# EAGLE board Edgecutter (EAGLE 7.7.0)
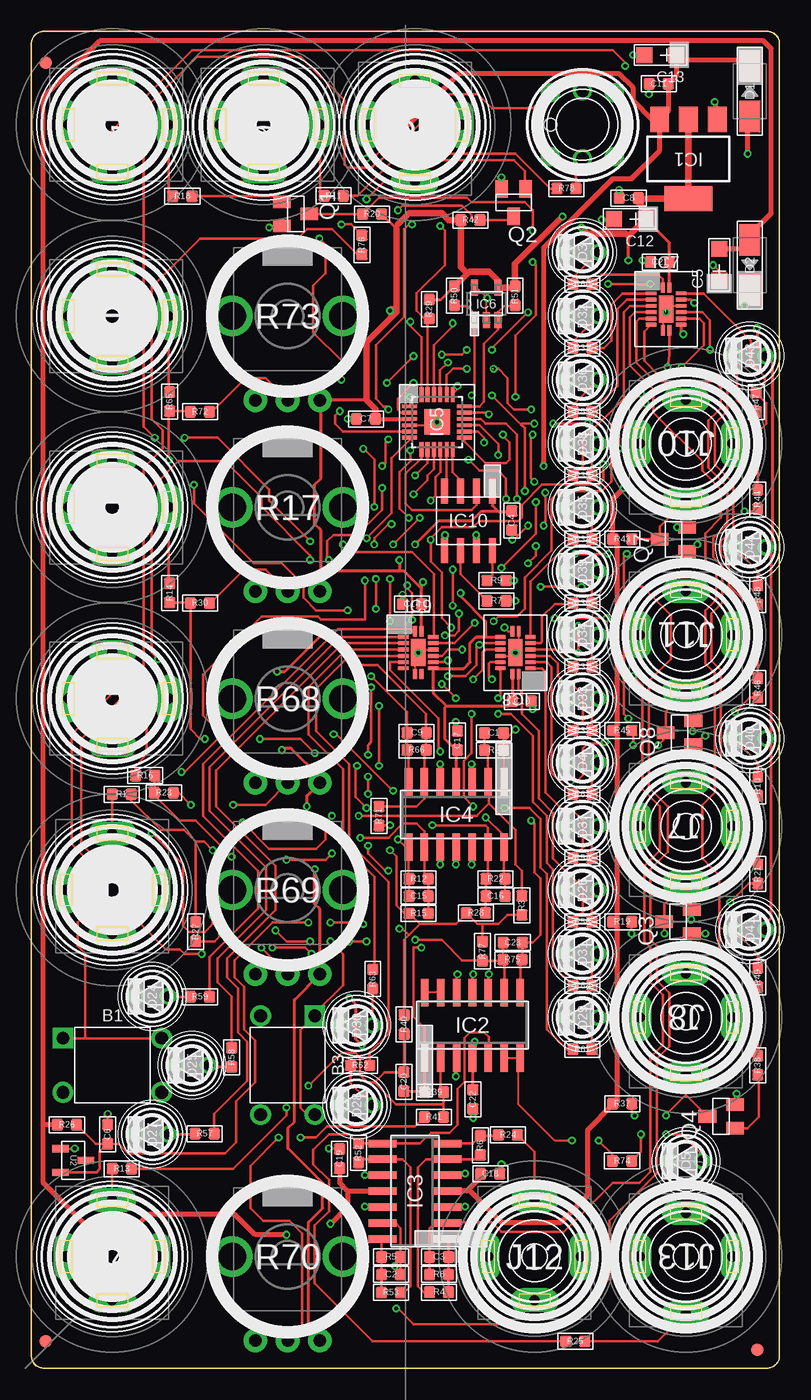
[diagram p6: board, top side]
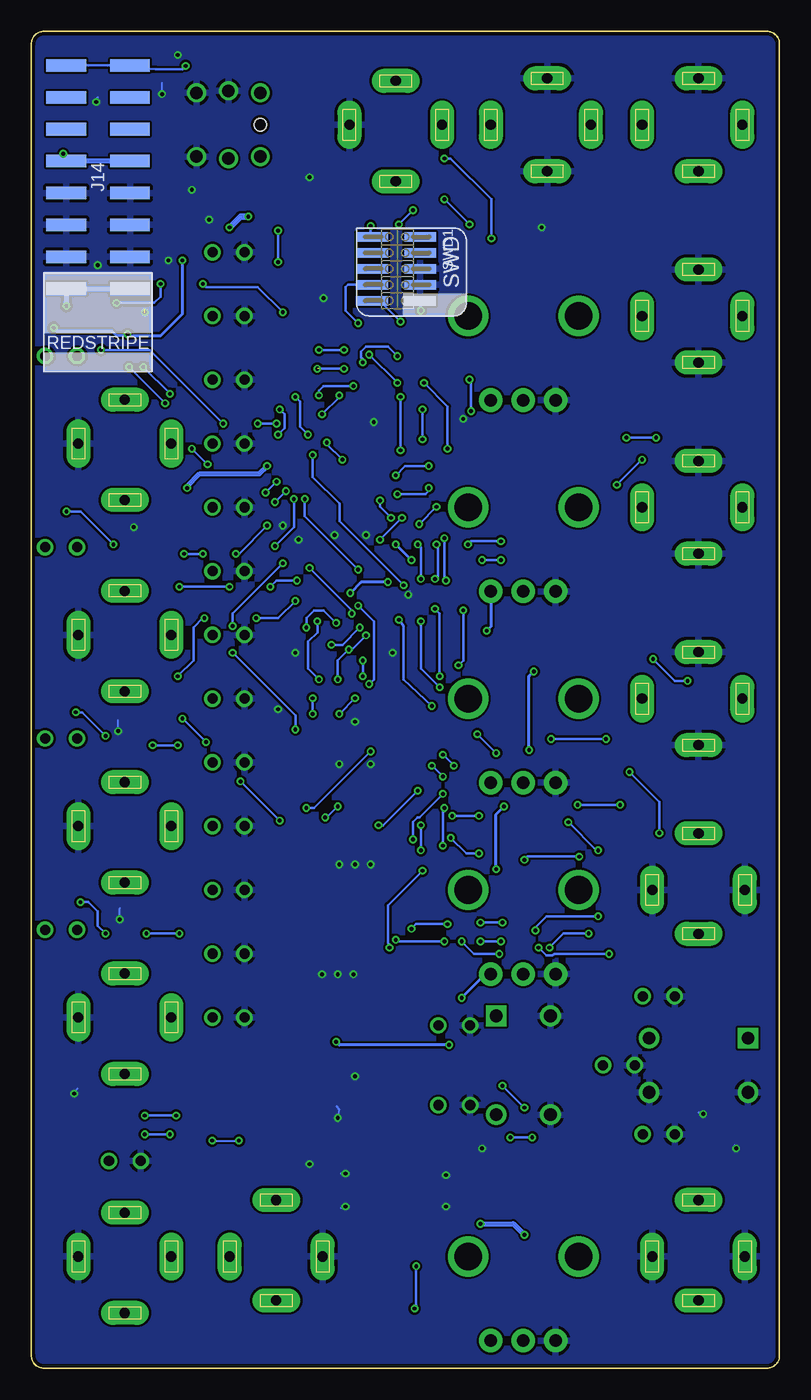
[diagram p7: board, bottom side, seen from below]

Size 59.62 x 106.5 mm. Coordinates in mm from the lower left corner, seen from the top.
Copper layers (1*16): Top 0.035mm / dielectric 1.5mm / Bottom 0.035mm
Design rules "dirt_cheap_dirty_boards.v1 *": minimum track width 5mil, minimum drill 12mil, track to track 5mil, track to pad 5mil, pad to pad 5mil, via to via 5mil, smd to smd 0mil, copper to edge 10mil, drill to drill 10mil, minimum pad ring 10mil, minimum via ring 6mil, stop-mask expansion 2mil, vias tented up to drill 25mil, thermal gap 10mil
Net classes: 0 default: width 0.203 mm, clearance 0.178 mm; 1 heavypower: width 0.381 mm; 2 mediumpower: width 0.254 mm; 3 groundplane: width 0.178 mm, clearance 0.178 mm

## Footprints (pad centres in the part's own frame; a part is rotated, then mirrored left to right if it is on the bottom)
4P-6.0X6.0X5.0H = drill 1.016 pad 1.651 square: 1 -3.937,2.159 | drill 1.016 pad 1.651: 2 -3.937,-2.159; 3 3.937,-2.159; 4 3.937,2.159
C0603 = smd 0.889 x 0.889: 1 -0.762,0; 2 0.762,0
AVX-A = smd 1.27 x 1.27: + -1.27,0; - 1.27,0
DO-214AC = smd 2.5 x 1.7: 1 -2,0; 2 2,0
3MMLED = drill 0.8: + -1.27,0; - 1.27,0
FIDUCIAL_1MM = smd 1 x 1: 1 0,0
SOT223 = smd 1.5 x 2: 1 -2.3,-3.15; 2 0,-3.15; 3 2.3,-3.15 | smd 3.8 x 2: 4 0,3.15
SO14 = smd 0.6 x 2.2: 1 -3.81,-2.6; 2 -2.54,-2.6; 3 -1.27,-2.6; 4 0,-2.6; 5 1.27,-2.6; 6 2.54,-2.6; 7 3.81,-2.6; 8 3.81,2.6; 9 2.54,2.6; 10 1.27,2.6; 11 0,2.6; 12 -1.27,2.6; 13 -2.54,2.6; 14 -3.81,2.6
QFN50P400X400X100-25N = smd 1.2 x 0.3: 1 -2.2,1.245; 2 -2.2,0.762; 3 -2.2,0.254; 4 -2.2,-0.254; 5 -2.2,-0.762; 6 -2.2,-1.245; 13 2.2,-1.245; 14 2.2,-0.762; 15 2.2,-0.254; 16 2.2,0.254; 17 2.2,0.762; 18 2.2,1.245 | smd 0.3 x 1.2: 7 -1.245,-2.2; 8 -0.762,-2.2; 9 -0.254,-2.2; 10 0.254,-2.2; 11 0.762,-2.2; 12 1.245,-2.2; 19 1.245,2.2; 20 0.762,2.2; 21 0.254,2.2; 22 -0.254,2.2 | smd 0.305 x 1.2: 23 -0.762,2.2; 24 -1.245,2.2 | smd 2.032 x 2.032: 25 0,0
SOT95P290X145-5N = smd 1.27 x 0.559: 1 -1.295,0.94; 2 -1.295,0; 3 -1.295,-0.94; 4 1.295,-0.94; 5 1.295,0.94
QFN50P250X350X100-17N = smd 0.305 x 0.813: 1 -0.254,1.702; 8 -0.254,-1.702; 9 0.254,-1.702; 16 0.254,1.702 | smd 0.813 x 0.305: 2 -1.194,1.245; 3 -1.194,0.762; 4 -1.194,0.254; 5 -1.194,-0.254; 6 -1.194,-0.762; 7 -1.194,-1.245; 10 1.194,-1.245; 11 1.194,-0.762; 12 1.194,-0.254; 13 1.194,0.254; 14 1.194,0.762; 15 1.194,1.245 | smd 1.143 x 2.159: 17 0,0
SOIC8-N_MC = smd 1.981 x 0.559: 1 -2.362,1.905; 2 -2.362,0.635; 3 -2.362,-0.635; 4 -2.362,-1.905; 5 2.362,-1.905; 6 2.362,-0.635; 7 2.362,0.635; 8 2.362,1.905
3.5MM-JACK-SWITCH-13MM-INPUT = drill 0.8 pad 1.93 long: RING@3 -3.7,0; SECOND@3 0,-3.5; SWITCH@3 3.7,0; TIP@3 0,4.5
3.5MM-JACK-SWITCH-13MM-OUTPUT = drill 0.8 pad 1.93 long: RING@3 -3.7,0; SECOND@3 0,-3.5; SWITCH@3 3.7,0; TIP@3 0,4.5
2X08_SMT_HEADER = smd 1 x 3.17: 1 -8.89,-2.54; 2 -8.89,2.54; 3 -6.35,-2.54; 4 -6.35,2.54; 5 -3.81,-2.54; 6 -3.81,2.54; 7 -1.27,-2.54; 8 -1.27,2.54; 9 1.27,-2.54; 10 1.27,2.54; 11 3.81,-2.54; 12 3.81,2.54; 13 6.35,-2.54; 14 6.35,2.54; 15 8.89,-2.54; 16 8.89,2.54
SOT23-BEC = smd 1 x 1.4: B -0.95,-1.1; C 0,1.1; E 0.95,-1.1
R0603 = smd 0.889 x 0.889: 1 -0.762,0; 2 0.762,0
OG-POTS_ALPS_POT_VERTICAL = drill 1 pad 1.88: P$1 -2.58,-6.7; P$2 0,-6.7; P$3 2.58,-6.7 | drill 2.2 pad 3.175: P$4 4.4,0; P$5 -4.4,0
M50-3600542 = smd 0.75 x 2.5: 1 -2.54,-1.81; 2 -2.54,2; 3 -1.27,-1.81; 4 -1.27,2; 5 0,-1.81; 6 0,2; 7 1.27,-1.81; 8 1.27,2; 9 2.54,-1.81; 10 2.54,2
SOT95P237X112-3N = smd 1.321 x 0.559: 1 -1.016,0.94; 2 -1.016,-0.94; 3 1.016,0
PB6149L = drill 1: 1 2.54,2.54; 2 2.54,-2.54; 3 -2.54,2.54; 4 -2.54,-2.54; LEDNEG 0,-2.7; LEDPOS 0,2.7 | hole 1: 2.54,0

## Placement (x,y rotation side)
B1  BUTTON-4P-3110040P1  [4P-6.0X6.0X5.0H]  6.45,24.13 0 top
B3  BUTTON-4P-3110040P1  [4P-6.0X6.0X5.0H]  20.42,24.13 270 top
C1  3.3nF  [C0603]  36.86,50.6 0 top
C2  3.3nF  [C0603]  28.66,7.46 180 top
C3  3.3nF  [C0603]  32.48,8.86 0 top
C4  100nF  [C0603]  38.29,67.53 90 top
C5  10uF  [AVX-A]  54.82,87.9 90 top
C6  100nF  [C0603]  6.08,18.64 270 top
C7  100nF  [C0603]  26.66,75.62 0 top
C8  100nF  [C0603]  47.6,93.22 0 top
C9  3.3nF  [C0603]  30.7,50.62 180 top
C10  100nF  [C0603]  39.08,53.12 180 top
C11  100nF  [C0603]  49.99,102.32 0 top
C12  10uF  [AVX-A]  47.68,91.55 180 top
C13  10uF  [AVX-A]  50.14,104.62 180 top
C14  100nF  [C0603]  30.33,60.88 0 top
C15  3.3nF  [C0603]  30.86,37.6 180 top
C16  3.3nF  [C0603]  36.99,37.6 0 top
C17  100nF  [C0603]  33.95,50 90 top
C18  100nF  [C0603]  36.57,15.49 180 top
C19  100nF  [C0603]  24.57,16.69 270 top
C20  3.3nF  [C0603]  29.69,22.82 270 top
C21  100nF  [C0603]  50.08,88.12 0 top
C22  100nF  [C0603]  35.18,21.41 270 top
C23  3.3nF  [C0603]  38.36,33.9 0 top
D1  MRA4004T3G  [DO-214AC]  57.25,101.73 90 top
D2  MRA4004T3G  [DO-214AC]  57.25,87.88 270 top
D3  yellow  [3MMLED]  43.91,88.9 180 top
D4  yellow  [3MMLED]  43.91,48.26 180 top
D5  yellow  [3MMLED]  52.17,16.51 180 top
D24  yellow  [3MMLED]  9.62,29.62 180 top
D25  yellow  [3MMLED]  12.8,24.13 180 top
D26  yellow  [3MMLED]  43.91,38.1 180 top
D27  yellow  [3MMLED]  9.62,18.63 180 top
D28  yellow  [3MMLED]  25.92,20.95 180 top
D29  yellow  [3MMLED]  43.91,27.94 180 top
D30  yellow  [3MMLED]  25.92,27.3 180 top
D31  yellow  [3MMLED]  43.91,33.02 180 top
D32  yellow  [3MMLED]  43.91,83.82 180 top
D33  yellow  [3MMLED]  43.91,53.34 180 top
D34  yellow  [3MMLED]  43.91,58.42 180 top
D35  yellow  [3MMLED]  43.91,68.58 180 top
D36  yellow  [3MMLED]  43.91,78.74 180 top
D37  yellow  [3MMLED]  43.91,43.18 180 top
D38  yellow  [3MMLED]  43.91,73.66 180 top
D39  yellow  [3MMLED]  43.91,63.5 180 top
D40  yellow  [3MMLED]  57.25,50.16 180 top
D41  yellow  [3MMLED]  57.25,34.92 180 top
D43  yellow  [3MMLED]  57.25,80.64 180 top
D44  yellow  [3MMLED]  57.25,65.41 180 top
FID1  FIDUCIAL  [FIDUCIAL_1MM]  1.15,104.01 180 top
FID2  FIDUCIAL  [FIDUCIAL_1MM]  57.86,1.46 0 top
FID3  FIDUCIAL  [FIDUCIAL_1MM]  1.13,2.13 0 top
IC1  LD1117AS33TR  [SOT223]  52.36,96.33 180 top
IC2  MCP6004  [SO14]  35.15,27.32 0 top
IC3  TL074D  [SO14]  30.58,14.1 90 top
IC4  MCP6004  [SO14]  33.86,44.1 180 top
IC5  MKL02Z32VFK4  [QFN50P400X400X100-25N]  32.33,75.38 0 top
IC6  24LC16T-I/OT  [SOT95P290X145-5N]  36.25,84.8 90 top
IC7  74HC595BQ  [QFN50P250X350X100-17N]  50.58,84.38 0 top
IC8  74HC595BQ  [QFN50P250X350X100-17N]  38.58,57 180 top
IC9  74HC595BQ  [QFN50P250X350X100-17N]  30.83,57 0 top
IC10  MCP4822-E/SN  [SOIC8-N_MC]  34.83,67.5 270 top
J1  PJ-341  [3.5MM-JACK-SWITCH-13MM-INPUT]  6.45,68.58 270 top
J2  PJ-341  [3.5MM-JACK-SWITCH-13MM-INPUT]  6.45,53.34 270 top
J3  PJ-341  [3.5MM-JACK-SWITCH-13MM-INPUT]  6.45,38.1 0 top
J4  PJ-341  [3.5MM-JACK-SWITCH-13MM-INPUT]  6.45,8.89 0 top
J5  PJ-341  [3.5MM-JACK-SWITCH-13MM-INPUT]  6.45,99.06 270 top
J6  PJ-341  [3.5MM-JACK-SWITCH-13MM-INPUT]  18.52,99.06 270 top
J7  PJ-341  [3.5MM-JACK-SWITCH-13MM-OUTPUT]  52.17,43.18 180 top
J8  PJ-341  [3.5MM-JACK-SWITCH-13MM-OUTPUT]  52.17,27.94 180 top
J9  PJ-341  [3.5MM-JACK-SWITCH-13MM-INPUT]  30.58,99.06 180 top
J10  PJ-341  [3.5MM-JACK-SWITCH-13MM-OUTPUT]  52.17,73.66 180 top
J11  PJ-341  [3.5MM-JACK-SWITCH-13MM-OUTPUT]  52.17,58.42 180 top
J12  PJ-341  [3.5MM-JACK-SWITCH-13MM-OUTPUT]  40.1,8.89 0 top
J13  PJ-341  [3.5MM-JACK-SWITCH-13MM-OUTPUT]  52.17,8.89 180 top
J14  POWERSMT  [2X08_SMT_HEADER]  54.3,94.89 90 bottom
J15  PJ-341  [3.5MM-JACK-SWITCH-13MM-INPUT]  6.45,83.82 270 top
OUTLINE  EURORACK_PCB12HP  [EURORACK12HPPCB]  -0.5,0 0 top
Q1  MMBT3904  [SOT23-BEC]  21.06,91.95 270 top
Q2  MMBT3904  [SOT23-BEC]  38.44,92.86 180 top
Q3  MMBT3904  [SOT23-BEC]  51.53,35.56 90 top
Q4  MMBT3904  [SOT23-BEC]  54.97,20.06 90 top
Q7  MMBT3904  [SOT23-BEC]  51.17,66.04 90 top
Q8  MMBT3904  [SOT23-BEC]  51.66,50.62 90 top
R1  100k  [R0603]  7.2,45.72 180 top
R2  33k  [R0603]  36.86,49.23 180 top
R3  51k  [R0603]  39.09,36.87 270 top
R4  100k  [R0603]  32.48,6.05 180 top
R5  30k  [R0603]  28.66,8.86 0 top
R6  100k  [R0603]  35.78,17.75 90 top
R7  12k  [R0603]  37.07,61.12 180 top
R8  30k  [R0603]  32.48,7.46 180 top
R9  12k  [R0603]  37.07,62.75 180 top
R10  56  [R0603]  57.88,46.35 270 top
R11  100k  [R0603]  24.09,93.4 0 top
R12  33k  [R0603]  30.86,38.98 0 top
R13  100k  [R0603]  7.21,15.88 180 top
R14  100k  [R0603]  11.03,61.76 90 top
R15  51k  [R0603]  30.86,36.23 180 top
R16  100k  [R0603]  9.07,47.21 180 top
R17  10kB  [OG-POTS_ALPS_POT_VERTICAL]  20.42,68.58 0 top
R18  100k  [R0603]  12.04,93.36 0 top
R19  10k  [R0603]  47.09,35.56 180 top
R20  10k  [R0603]  27.14,91.94 0 top
R21  100k  [R0603]  57.88,39.37 270 top
R22  33k  [R0603]  36.99,38.98 180 top
R23  33k  [R0603]  10.56,45.84 0 top
R24  100  [R0603]  37.98,18.59 180 top
R25  100  [R0603]  43.35,2.13 180 top
R26  10k  [R0603]  2.83,19.39 0 top
R27  33k  [R0603]  13.09,34.77 270 top
R28  51k  [R0603]  35.42,36.27 180 top
R29  10k  [R0603]  31.7,84.38 270 top
R30  33k  [R0603]  13.44,60.96 0 top
R31  56  [R0603]  43.91,55.88 180 top
R32  56  [R0603]  43.91,50.8 180 top
R33  56  [R0603]  43.91,81.28 0 top
R34  56  [R0603]  43.91,66.04 180 top
R35  56  [R0603]  43.91,71.12 180 top
R36  56  [R0603]  43.91,60.96 180 top
R37  10k  [R0603]  47.09,21.07 180 top
R38  100k  [R0603]  57.88,24.13 270 top
R39  33k  [R0603]  32.1,21.98 0 top
R40  51k  [R0603]  29.7,27.38 90 top
R41  33k  [R0603]  32.08,20 180 top
R42  10k  [R0603]  35,91.47 180 top
R43  10k  [R0603]  47.09,66.04 180 top
R44  100k  [R0603]  57.88,69.22 270 top
R45  10k  [R0603]  47.09,50.8 180 top
R46  100k  [R0603]  57.88,54.19 270 top
R47  56  [R0603]  57.76,76.96 90 top
R48  56  [R0603]  57.88,61.59 270 top
R49  56  [R0603]  57.88,31.11 270 top
R50  2k  [R0603]  33.71,85.43 270 top
R51  2k  [R0603]  38.55,85.43 270 top
R52  100k  [R0603]  26.07,17.14 90 top
R53  100k  [R0603]  28.66,6.03 0 top
R54  56  [R0603]  43.91,40.64 180 top
R55  56  [R0603]  43.91,76.2 0 top
R56  56  [R0603]  43.91,35.56 180 top
R57  56  [R0603]  13.82,18.68 0 top
R58  56  [R0603]  15.97,24.77 90 top
R59  56  [R0603]  13.44,29.59 0 top
R60  56  [R0603]  43.91,86.36 0 top
R61  56  [R0603]  43.91,25.4 180 top
R62  56  [R0603]  26.2,24.12 0 top
R63  56  [R0603]  27.2,31 90 top
R64  56  [R0603]  43.91,30.48 180 top
R65  100k  [R0603]  11.02,77 90 top
R66  33k  [R0603]  30.7,49.25 0 top
R67  56  [R0603]  43.91,45.72 180 top
R68  10kB  [OG-POTS_ALPS_POT_VERTICAL]  20.42,53.34 0 top
R69  10kB  [OG-POTS_ALPS_POT_VERTICAL]  20.42,38.1 0 top
R70  10kB  [OG-POTS_ALPS_POT_VERTICAL]  20.42,8.89 0 top
R71  51k  [R0603]  27.7,43.99 270 top
R72  33k  [R0603]  13.44,76.2 0 top
R73  10kB  [OG-POTS_ALPS_POT_VERTICAL]  20.42,83.82 0 top
R74  56  [R0603]  47.08,16.51 180 top
R75  33k  [R0603]  38.34,32.55 180 top
R76  100k  [R0603]  26.34,89.48 90 top
R77  51k  [R0603]  35.95,33.22 90 top
R78  56  [R0603]  42.64,93.98 180 top
SWD1  CORTEX_SWD  [M50-3600542]  30.45,87.58 90 bottom
U2  LM4040DIM3-5.0  [SOT95P237X112-3N]  3.33,16.55 0 top
U$2  SWITCH_W_LED_PB6149L-X-102YELLOW  [PB6149L]  43.91,99.06 180 top

## Tracks (layer width: path | path; a pad name or v marks a point on that pad's centre or on a via)
3.3V  (via drill 0.3)
  Top 0.254: IC10.1 36.73,68.72 37.2,68.25 | 37.2,68.25 38.25,68.25 C4.2 | C8.2 48.4,93.18 48.4,92.81 | D41.+ 58.52,35.44 58.95,35.88 58.95,49.73 D40.+ 58.52,50.19 58.95,50.62 58.95,64.97 D44.+ 58.52,65.44 59.08,66 59.08,80.08 D43.+ | 38.58,86.09 R51.1 | IC6.4 37.2,86.64 | 34.9,87.38 34.74,87.22 | 33.66,86.25 R50.1 32.66,85.14 R29.1 | R70.P$3 23,2.46 22.08,3.38 22.08,11.62 23.2,12.75 23.2,14.75 20.45,17.5 20.45,19.12 20.95,19.62 20.95,29.36 R69.P$3 23,36.58 22.58,37 v22.58,39.75 | R20.2 29.08,90.76 29.2,91.12 | IC5.3 | C22.1 35.18,24.68 IC2.4 | 35.96,58.24 35.45,58.24 34.95,57.75 34.95,56.25 34.45,55.75 IC9.10 32.02,53.81 33.08,52.75 | 35.96,58.24 36.2,58.24 | 36.2,58.24 IC8.10 | IC9.16 31.08,60.3 C14.2 31.09,62.11 | IC8.16 38.33,53.13 C10.2 37.94,52.75 33.08,52.75 | IC7.16 C21.2 arc-90 C21.2 50.84,89.65 C12.+ | R17.P$3 23.08,61.8 23.08,63.5 | 26.7,77.12 R73.P$3 23.08,77.04 23.08,70.88 22.58,70.38 22.58,67.25 23.08,66.75 23.08,63.5 | v28.58,84.25 28.7,84.38 | D43.+ 58.52,80.69 | IC7.10 51.77,82.56 v51.95,82.38 | v47.58,88.25 47.58,90.18 | v57.83,82.88 57.83,81.33 D43.+ | 29.2,63.5 29.7,63.5 31.09,62.11 | 29.2,63.5 23.08,63.5 | 37.2,68.25 35.83,68.25 35.08,67.5 32.45,67.5 v30.58,65.62 | v29.33,64.38 29.33,63.62 29.2,63.5 | IC4.4 33.86,49.15 C17.1 33.84,49.24 32.95,50.12 32.95,52.62 33.08,52.75 | IC2.4 35.15,25.82 v35.33,26 35.33,24.9 IC2.4 | v25.33,29.5 25.83,29 25.83,26.25 v26.33,25.75 | v21.95,44.75 21.95,45.59 R68.P$3 23,47.08 20.7,49.38 20.08,49.38 v19.95,49.25 | v19.58,55.5 20.2,55.5 23.33,58.62 v23.33,58.75 | 35.96,58.24 35.46,58.24 | 31.09,62.11 31.09,62.51 v31.2,62.62 | v34.2,61.75 34.2,61.5 36.2,59.5 36.2,58.24
  Top 0.305: C7.2 IC5.3
  Top 0.508: IC1.2 IC1.4 48.4,93.18 | 48.4,92.81 49.08,92.12 49.08,91.68 C12.+ 47.58,90.18 47.39,90.38 44.33,90.38 v43.83,90.88 | IC6.4 38.58,86.09 | 37.2,86.64 36.45,87.38 34.9,87.38 | R50.1 34.74,87.22 34.24,87.72 R42.2 33.24,91.47 32.7,92 30.08,92 29.2,91.12 | 29.08,90.76 29.08,84.12 28.7,83.75 | C7.2 27.42,76.41 26.7,77.12 26.7,81.75 28.7,83.75 | 28.7,84.38 28.7,83.75 | R51.1 38.55,87.97 v42.33,91.75
  Bottom 0.254: SWD1.1 28.65,84.44 v28.58,84.25 | v47.58,88.25 47.58,84 49.33,82.25 51.83,82.25 v51.95,82.38 51.95,82.25 52.83,82.25 53.2,82.62 57.58,82.62 v57.83,82.88 | v30.58,65.62 v29.33,64.38 | R69.P$3 23.43,31.4 v25.33,29.5 | v26.33,25.75 35.08,25.75 v35.33,26 | v22.58,39.75 22.58,44.12 v21.95,44.75 | v19.95,49.25 19.95,55.12 v19.58,55.5 | R17.P$3 23,59.08 v23.33,58.75 | v31.2,62.62 33.33,62.62 v34.2,61.75
  Bottom 0.508: v42.33,91.75 42.95,91.75 v43.83,90.88
12V  (via drill 0.3)
  Top 0.381: C18.2 35.81,15.23 34.83,14.25 | 34.83,14.25 34.7,14.12 33.21,14.12 IC3.4 | IC1.3 50.75,100.17 C11.2 51.41,102.98 C13.+ 51.79,104.23 56.75,104.23 D1.2 | IC1.3 49.48,99.48 47.95,101 47.95,102 46.83,103.12 34.08,103.12 29.95,99 26.94,99 J9.SWITCH@3 | 34.83,14.25 37.45,11.62 42.2,11.62 44.33,13.75 44.33,19 46.33,21 R37.2 46.7,21.45 46.7,35.18 R19.2 46.39,35.56 46.7,35.88 46.7,50.42 R45.2 46.33,50.87 46.7,51.25 46.7,65.66 R43.2 46.33,69.25 v47.2,70.12 | v40.83,71.88 40.83,89.25 46.33,94.75 47.83,94.75 50.08,97 50.08,99.46 IC1.3
  Bottom 0.381: v47.2,70.12 47.2,70.25 46.2,71.25 41.45,71.25 v40.83,71.88
-12V  (via drill 0.3)
  Top 0.381: IC3.11 25.23,14.1 25.2,14.12 | 25.2,14.12 24.58,14.75 24.58,15.92 C19.2 | C5.- 56.54,89.17 D2.1 57.25,90.3 58.95,92 58.95,105.12 58.33,105.75 5.46,105.75 0.96,101.25 0.96,19.38 | 25.2,14.12 25.2,12.88 v23.83,11.5 | v20.33,10.62 17.83,10.62 16.2,12.25 9.33,12.25 8.21,11.12 4.58,11.12 0.96,14.75 0.96,19.38 | R26.1 0.97,19.39 0.96,19.38
  Bottom 0.381: v23.83,11.5 21.2,11.5 v20.33,10.62
ADC_ATTACK  (via drill 0.3)
  Top 0.203: IC4.7 30.05,49.14 R66.1 C9.2 29.94,52.26 v27.08,55.12 | v27.45,60.5 v27.45,62.88 | v27.33,68.62 27.33,72.38 v26.45,73.25 | v28.7,67.25 28.45,67.25 27.33,66.12 v27.33,65.62 | v33.2,80.12 32.58,79.5 32.58,77.62 IC5.21 | v28.33,78.5 v30.45,80.62
  Bottom 0.203: v27.08,55.12 27.08,60.12 v27.45,60.5 | v28.33,78.5 26.45,76.62 v26.45,73.25 | v28.7,67.25 v27.33,68.62 | v27.33,65.62 27.2,65.5 27.2,63.12 v27.45,62.88 | v33.2,80.12 33.2,80.38 33.33,80.5 33.33,81 32.95,81.38 31.2,81.38 v30.45,80.62
ADC_CURVE  (via drill 0.3)
  Top 0.203: C20.2 31.26,22.06 R39.1 IC2.1 31.34,27.11 30.45,28 30.45,33.5 v31.08,33.5 | IC5.10 32.58,71.38 32.2,71 32.2,69.5 v31.83,69.12 | v27.08,54.25 27.08,49.88 26.83,49.62 v26.83,48.88 | v28.58,62.88 v28.58,59.5 | v30.95,67.75 v28.83,65.62 | v28.45,39.62 28.2,39.62 26.83,41 v26.83,41.62 | v26.7,44.62 25.83,45.5 25.83,47.88 v25.95,48
  Bottom 0.203: v31.83,69.12 31.83,68.62 v30.95,67.75 | v27.08,54.25 28.58,55.75 v28.58,59.5 | v28.58,62.88 28.58,65.38 v28.83,65.62 | v31.08,33.5 31.08,33.75 31.2,33.88 31.2,36.88 v28.45,39.62 | v26.83,41.62 26.83,44.5 v26.7,44.62 | v26.83,48.88 v25.95,48
ADC_DECAY  (via drill 0.3)
  Top 0.203: C16.2 R22.1 37.67,39.06 IC4.14 37.58,41.62 37.58,42.5 v36.2,43.88 | IC5.14 35.59,74.61 36.08,74.12 v36.08,73.75 | v37.83,69.25 37.83,70.88 37.2,71.5 35.7,71.5 v34.83,72.38 | v33.58,60.75 v33.58,63.62 | v33.83,53.38 v32.7,54.5 | v35.08,52.12 35.08,49 34.45,48.38 34.45,45.5 v35.2,44.75
  Bottom 0.203: v37.83,69.25 37.83,67.88 v33.58,63.62 | v33.58,60.75 32.33,59.5 32.33,54.88 v32.7,54.5 | v35.08,52.12 v33.83,53.38 | v35.2,44.75 36.08,43.88 v36.2,43.88 | v34.83,72.38 36.08,73.62 v36.08,73.75
ADC_RELEASE  (via drill 0.3)
  Top 0.203: IC4.1 37.67,49.18 R2.1 37.63,50 | 37.63,50 C1.2 | IC5.16 35.83,75.63 36.2,75.25 37.83,75.25 38.7,74.38 v38.7,69.25 | v40.2,65.5 40.2,64.75 v39.58,64.12 | v43.58,57 v43.58,59.12 | v38.58,50.88 37.7,50 37.63,50
  Bottom 0.203: v38.7,69.25 38.7,67 v40.2,65.5 | v39.58,64.12 43.58,60.12 v43.58,59.12 | v43.58,57 38.58,52 v38.58,50.88
ADC_SUSTAIN  (via drill 0.3)
  Top 0.203: C15.2 R12.1 30.05,39.03 IC4.8 29.95,41.38 v29.2,42.12 | IC5.15 35.71,75.12 37.2,73.62 v37.2,72.75 | v29.95,62.38 29.95,62.12 30.33,61.75 v30.33,59.62 | v27.7,48 v27.7,52.75 | v26.83,45.75 v26.83,47.12
  Bottom 0.203: v37.2,72.75 37.2,71 35.08,68.88 35.08,67.5 v29.95,62.38 | v30.33,59.62 29.95,59.12 29.95,54.88 v27.7,52.75 | v26.83,47.12 v27.7,48 | v26.83,45.75 28.7,43.88 28.83,43.88 29.2,43.5 v29.2,42.12
ADC_VELOCITY  (via drill 0.3)  (1 unrouted)
  Top 0.203: IC2.8 38.96,32.4 R75.1 39.12,32.57 C23.2 39.98,33.9 40.58,34.5 40.58,39 40.08,39.5 40.08,43.38 v39.83,43.62 | v42.95,46.75 43.45,46.75 43.95,47.25 43.95,49.38 44.33,49.75 45.58,49.75 v45.7,49.88 | v47.58,51.75 47.2,52.12 47.2,64.62 v47.45,64.88 | v43.33,64.88 v45.95,64.88 | v40.95,69.75 40.95,67.25 v40.83,67.12 | v40.08,70.62 39.83,70.88 39.83,74.25 v39.95,74.38 | v39.83,76.38 38.45,76.38 37.95,76.88 37.95,78.88 37.2,79.62 36.7,79.62 | v34.7,79.62 33.58,79.62 33.08,79.12 33.08,77.62 IC5.20
  Bottom 0.203: v42.95,46.75 v39.83,43.62 | v47.58,51.75 v45.7,49.88 | v45.95,64.88 v47.45,64.88 | v40.08,70.62 v40.95,69.75 | v39.95,74.38 39.45,74.88 39.45,76 v39.83,76.38 | v34.7,79.62 v36.83,79.62 | v40.83,67.12 43.08,64.88 v43.33,64.88
BUTTON_LOOP  (via drill 0.3)
  Top 0.203: B3.4 22.01,20.19 21.45,20.75 21.45,26.94 B3.1 22.58,28.25 24.83,30.5 24.83,33 v23.83,34 | IC5.6 30.13,73.92 28.7,72.5 28.7,68.12 v26.7,66.12 | v26.58,62.75 26.58,59.62 23.08,59.62 22.83,59.88 18.33,59.88 13.71,55.25 13.71,52 14.83,50.88 14.83,50.12 12.21,47.5 v11.96,47.5 | v22.2,34 20.33,34 v19.45,34.88 | v14.46,36 14.46,35.38 13.83,34.75 12.58,34.75 12.08,35.25 12.08,40.12 v9.58,42.62
  Bottom 0.203: v26.7,66.12 26.7,62.88 v26.58,62.75 | v23.83,34 v22.2,34 | v19.45,34.88 19.45,35.12 18.58,36 v14.46,36 | v9.58,42.62 9.58,45.12 v11.96,47.5
BUTTON_TIMERANGE  (via drill 0.3)
  Top 0.203: B1.1 4.27,26.29 | 4.27,26.29 B1.4 | IC5.9 32.08,71.62 31.58,71.12 31.58,70.75 v30.45,69.62 | 4.27,26.29 4.27,33.06 3.71,33.62 3.71,35.5 4.58,36.38 4.58,40.38 3.21,41.75 3.21,50.5 7.46,54.75 v7.33,54.75 | v10.08,56.5 9.58,57 9.58,70.12 11.71,72.25 15.46,72.25 18.33,69.38 18.33,68.62 22.2,64.75 v22.2,64.38 | v23.7,64.38 23.58,64.5 23.58,65.88 24.08,66.38 25.95,66.38 27.95,68.38 v27.95,70.12
  Bottom 0.203: v7.33,54.75 8.33,54.75 v10.08,56.5 | v23.7,64.38 v22.2,64.38 | v30.45,69.62 28.2,69.62 27.95,69.88 v27.95,70.12
BUTTON_TRIGGER  (via drill 0.3)
  Top 0.203: IC5.5 24.84,74.61 24.2,75.25 24.2,75.88 v24.58,76.25 | v24.7,78.75 24.7,80.25 22.45,82.5 22.45,86.25 23.45,87.25 23.45,89.5 v22.95,90 | U$2.2 41.18,101.6 40.08,100.5 40.08,100.38 | 40.08,100.38 40.08,97.81 U$2.1 | 40.08,100.38 36.7,100.38 35.58,101.5 33.33,101.5 29.83,98 28.83,98 27.2,96.38 v26.7,96.38
  Bottom 0.203: v24.58,76.25 24.58,78.62 v24.7,78.75 | v22.95,90 22.95,93.12 26.2,96.38 v26.7,96.38
CLOCK  (via drill 0.3)
  Top 0.203: IC9.11 32.04,56.25 33.2,56.25 arc90 v33.2,56.38 | v33.2,55.12 34.58,55.12 35.45,56 35.45,57.5 35.64,57.69 | 35.64,57.69 35.72,57.76 IC8.11 | IC7.11 53.22,83.61 53.58,83.25 53.58,81.5 v51.83,79.75 | v30.2,77.38 30.2,76.62 IC5.1 | v30.2,73.12 30.2,72.25 29.33,71.38 29.33,68.5 v30.08,67.75 | v35.7,57.62 35.64,57.69 | v48.95,76.88 46.83,74.75 v46.83,73.25 | v45.58,72 45.58,70.75 45.2,70.38 40.7,70.38 39.08,68.75 39.08,67.75 38.83,67.5 35.7,67.5 35.2,67 32.7,67 31.83,66.12 v31.83,66 31.83,64.25 32.7,63.38 32.7,59.75 v33.45,59
  Bottom 0.203: v33.2,56.38 v33.2,55.12 | v30.2,73.12 v30.2,77.38 | v31.83,66 v30.08,67.75 | v48.95,76.88 v51.83,79.75 | v45.58,72 v46.83,73.25 | v35.7,57.62 34.83,57.62 v33.45,59
CPU_RESET  (via drill 0.3)
  Top 0.203: IC5.23 31.57,83.48 R29.2 31.34,83.61 30.7,84.25 30.7,85.62 32.95,87.88 32.95,90.62 v32.58,91
  Bottom 0.203: v32.58,91 32.58,90.25 SWD1.10
D21
  Top 0.203: R47.1 57.13,76.2 56.2,77.12 56.2,80.42 D43.-
DACCS
  Top 0.203: IC10.2 35.46,68.76 35.08,68.38 30.33,68.38 29.83,68.88 29.83,71.25 31.08,72.5 IC5.7
DACSCK
  Top 0.203: IC5.12 33.57,71.38 34.2,70.75 34.2,69.87 IC10.3
DACSDI
  Top 0.203: IC5.11 33.09,70.03 IC10.4
EXTGATE  (via drill 0.3)
  Top 0.203: J5.SWITCH@3 6.46,98.62 12.83,105 46.33,105 47.33,104 v47.33,103.75
  Bottom 0.203: J14.16 J14.15 50.74,103.53 49.7,103.5 47.58,103.5 v47.33,103.75
GND  (via drill 0.3)  (1 unrouted)
  Top 0.178: IC1.1 54.66,100.67 v54.45,100.88 | C5.+ 54.82,87.38 v54.33,87.88 | C13.- 47.96,104.62 v47.95,104.62 | C11.1 49.26,102.45 v49.2,101.5 | Q4.E 56.07,21.74 v56.2,21.88 | Q3.E 52.57,36.26 v52.58,35.75 | Q8.E 52.66,51.42 v52.7,50.75 | Q2.E 37.49,94.84 v37.45,94.88 | Q1.E 19.08,91 v18.95,90.88 | C19.1 23.75,17.45 v23.7,17.5 | IC3.10 26.59,15.37 v26.58,15.38 | IC3.5 34.45,15.37 v34.58,15.5 | IC3.12 26.63,12.83 v26.58,12.88 | IC3.3 34.53,12.83 v34.58,12.88 | C8.1 v46.84,93.87 v46.83,93.88 | C12.- 45.5,91.55 v45.45,91.5 | IC6.5 35.49,86.09 v36.33,85.25 36.25,85.17 IC6.2 | IC4.5 32.59,48.11 v32.58,48.12 | IC4.3 35.13,48.07 v35.08,48.12 | IC4.10 32.59,40.14 v32.58,40.12 | IC4.11 33.86,40.16 v33.83,40.12 | IC4.12 35.13,40.18 v35.08,40.12 | C17.2 33.95,51.38 v33.83,51.5 | IC5.4 32.08,75.12 IC5.25 | IC10.7 35.46,66.36 v35.45,66.38 | IC10.5 32.92,66.34 v32.95,66.38 | IC2.10 36.42,31.34 v36.45,31.38 | IC2.11 35.15,31.32 v35.2,31.38 | IC2.12 33.88,31.3 v33.95,31.38 | IC2.3 33.88,23.3 v33.83,23.25 | C22.2 35.23,20.27 v35.2,19.94 | IC9.13 31.08,57.25 IC9.17 30.58,56.75 IC9.8 | IC8.17 38.33,57.25 | IC8.13 38.33,56.75 arc90 IC8.17 | IC8.8 38.83,57.25 arc-90 IC8.17 | C14.1 29.57,61.61 v29.58,61.62 | C10.1 39.84,52.61 v39.95,52.5 | IC7.8 50.33,84.12 v50.58,84.12 arc-90 50.83,84.63 IC7.13 | Q7.E 51.46,66.99 v51.45,67 | C21.1 48.83,88.12 v48.7,88.25 | C7.1 v25.2,75.62 | U2.1 v3.45,17.49 v3.46,17.5 | C6.1 v6.08,20.25 | C18.1 37.45,15.38 37.58,15.5 37.45,15.62 v37.45,16.25 37.58,16.38 | v39.58,67.12 38.45,66 v38.33,66 38.29,66.04 C4.1
  Bottom 0.178: v54.45,100.88 54.45,101.12 54.33,101.25 | v47.95,104.62 47.7,104.62 | v49.2,101.5 49.2,102.38 | v56.2,21.88 56.2,22 55.95,22.25 | v52.58,35.75 52.58,36.62 | v52.7,50.75 52.7,51.62 | v37.45,94.88 37.45,95.12 | v18.95,90.88 18.95,90.75 18.83,90.62 | v23.7,17.5 23.45,17.5 | v26.58,15.38 26.45,15.38 26.33,15.25 | v34.58,15.5 34.95,15.5 | v26.58,12.88 26.33,12.88 | v34.58,12.88 34.83,12.88 34.95,12.75 | v46.83,93.88 46.83,94 | v45.45,91.5 45.33,91.5 | v36.33,85.25 36.33,85 | v32.58,48.12 32.58,48.38 | v35.08,48.12 35.2,48.25 | v32.58,40.12 32.58,40 | v33.83,40.12 33.83,40 | v35.08,40.12 35.2,40 | v33.83,51.5 33.95,51.5 | v35.45,66.38 35.45,66.5 | v32.95,66.38 32.95,66.62 | 38.33,66.12 v38.33,66 | v36.45,31.38 36.58,31.38 | v35.2,31.38 35.45,31.38 | v33.95,31.38 34.08,31.38 | v33.83,23.25 33.83,23.12 | v35.2,19.94 35.08,20.56 35.27,20.88 | v29.58,61.62 29.58,61.75 29.45,61.88 | v39.95,52.5 39.95,52.25 | v51.45,67 51.2,67 | v48.7,88.25 48.45,88.25 | v25.2,75.62 24.95,75.62 | v3.46,17.5 3.46,17.62 3.58,17.75 | v6.08,20.25 6.33,20.25 6.46,20.38 | v37.45,16.25 37.7,16.25 | v39.58,67.12 39.83,67.25
  other vias: 30.83,57 38.58,57 32.33,75.38
  pour Bottom: -2.7,109.29 -2.7,-2.47 61.33,-2.54 61.33,109.22
KNOB_ATTACK
  Top 0.203: R73.P$2 18.66,78.88 17.08,78.88 14.4,76.2 R72.2
KNOB_CURVE  (via drill 0.3)
  Top 0.203: v19.7,18.38 17.45,16.12 17.45,12.75 18.45,11.75 20.58,11.75 21.58,10.75 21.58,3.35 R70.P$2 | v21.45,18.38 22.7,18.38 23.58,19.25 30.57,19.25 R41.2
  Bottom 0.203: v19.7,18.38 v21.45,18.38
KNOB_DECAY
  Top 0.203: R17.P$2 18.67,63.62 16.95,63.62 14.29,60.96 R30.2
KNOB_RELEASE  (via drill 0.3)
  Top 0.203: R27.2 14.59,34.01 v15.21,34.62 | v18.33,33.5 v18.33,33.49 R69.P$2
  Bottom 0.203: v15.21,34.62 17.2,34.62 v18.33,33.5
KNOB_SUSTAIN  (via drill 0.3)
  Top 0.203: 20.42,46.59 R68.P$2 18.66,44.88 v16.08,44.88 | R23.2 11.73,45.84 v12.71,44.88
  Bottom 0.203: v16.08,44.88 v12.71,44.88
LATCH  (via drill 0.3)
  Top 0.203: IC9.12 32.7,56.75 33.2,57.25 v34.33,57.25 | v35.2,54.88 35.95,55.62 35.95,57 36.21,57.25 IC8.12 | IC7.12 53.46,84.12 54.08,83.5 v54.08,81.12 | 39.02,75.19 v36.7,77.5 | 39.02,75.19 39.33,74.88 v39.33,69.88 | v40.2,69 40.2,66.5 v37.45,63.75 | IC5.19 33.58,77.62 33.95,78 v33.95,78.25 | v41.58,75.25 v44.33,75.25 | v40.08,75.25 39.08,75.25 39.02,75.19 | v32.95,58.38 33.7,58.38 34.08,58.75 v34.08,60.12
  Bottom 0.203: v35.2,54.88 35.2,56.38 v34.33,57.25 34.08,57.25 v32.95,58.38 | v40.2,69 v39.33,69.88 | v54.08,81.12 50.2,81.12 v44.33,75.25 | v40.08,75.25 v41.58,75.25 | v34.08,60.12 34.08,60.38 v37.45,63.75 | v36.7,77.5 36.7,77.88 36.33,78.25 v33.95,78.25
N$1
  Top 0.203: R78.1 43.41,95.85 U$2.LEDPOS
N$2
  Top 0.203: R6.1 35.43,16.64 IC3.6 33.17,16.62 31.45,16.62 30.83,16 30.83,6.5 31.28,6.05 R4.2
N$3
  Top 0.203: R16.2 8.31,47.98 9.21,48.88 9.21,51.59 J2.TIP@3
N$4  (via drill 0.3)
  Top 0.203: R15.1 C15.1 R12.2 31.32,39.28 IC4.9 31.32,42.76 30.7,43.38 29.58,43.38 28.45,42.25 v26.2,42.25 | v15.96,40.75 13.08,43.62 11.83,43.62 9.8,45.66 R23.1 9.84,45.88 R16.1 | v20.33,40.5 23.45,40.5 v23.95,41
  Bottom 0.203: v23.95,41 24.95,41 v26.2,42.25 | v15.96,40.75 20.08,40.75 v20.33,40.5
N$5
  Top 0.203: IC10.8 36.73,63.18 R9.2
N$6
  Top 0.203: J3.TIP@3 6.45,45.71 R1.2
N$7
  Top 0.203: R7.2 35.95,61.5 34.2,63.25 34.2,65.13 IC10.6
N$8  (via drill 0.3)
  Top 0.203: 36.45,45 36.45,46.66 IC4.2 36.41,48.93 R2.2 C1.1 | R1.1 7.96,45.24 10.33,42.88 12.16,42.88 13.09,41.95 | 13.09,41.95 R27.1 13.12,35.5 | R3.1 39.08,37.64 39.08,39.62 38.58,40.12 38.58,42.88 36.45,45 | 36.45,45 35.45,44 v26.08,44 | 13.09,41.95 13.76,41.95 v14.46,41.25 | v16.83,43.5 18.95,41.38 22.7,41.38 23.45,42.12 23.45,43.5 v23.95,44
  Bottom 0.203: v23.95,44 v26.08,44 | v14.46,41.25 14.58,41.25 v16.83,43.5
N$9  (via drill 0.3)
  Top 0.203: C2.1 29.43,8.19 | 29.43,8.19 R5.2 29.43,11.15 29.08,11.5 28.04,11.5 IC3.13 | 29.43,8.19 29.02,8.19 v28.95,8.12 | v29.08,4.75 29.2,4.75 30.45,3.5 42.45,3.5 46.08,7.12 46.08,11.75 49.83,15.5 49.83,24.62 50.83,25.62 50.83,29.88 49.83,30.88 49.83,33.62 49.33,34.12 49.33,39.75 50.7,41.12 50.7,44.75 49.2,46.25 49.2,54.75 50.95,56.5 50.95,60 48.7,62.25 v47.83,62.25 | R9.1 v38.45,62.75 | v40.58,62.25 v43.83,62.25
  Bottom 0.203: v28.95,8.12 28.95,4.88 v29.08,4.75 | v38.45,62.75 40.08,62.75 v40.58,62.25 | v43.83,62.25 v47.83,62.25
N$10  (via drill 0.3)
  Top 0.203: R8.2 C3.1 31.72,11.14 32.2,11.62 33.11,11.62 | 33.11,11.62 IC3.2 | 33.11,11.62 36.7,11.62 37.45,10.88 42.45,10.88 46.33,14.75 48.45,14.75 49.33,15.62 49.33,24.75 50.33,25.75 50.33,29.75 49.33,30.75 49.33,33.5 48.83,34 48.83,40 50.08,41.25 50.08,44.75 48.7,46.12 48.7,54.38 v47.95,55.12 | R7.1 v38.58,61.12 | v41.7,59.75 v45.83,59.75
  Bottom 0.203: v45.83,59.75 45.95,59.75 46.7,59 46.7,56.38 v47.95,55.12 | v41.7,59.75 39.95,59.75 v38.58,61.12
N$11
  Top 0.203: J15.TIP@3 10.95,77.84 R65.2
N$12
  Top 0.203: J4.TIP@3 R13.2
N$13  (via drill 0.3)
  Top 0.381: v57.08,96.75 57.08,100.06 D1.1
  Bottom 0.381: J14.9 J14.10 56.84,96.52 v57.08,96.75
N$14
  Top 0.203: IC8.7 39.77,62.66 R34.2
N$15
  Top 0.203: 19.75,93.11 Q1.B 19.5,93.36 R18.2
N$16
  Top 0.203: J5.TIP@3 10.95,93.44 R18.1
N$17
  Top 0.203: R53.2 29.73,6.03 30.2,6.5 30.2,16 29.58,16.62 27.99,16.62 IC3.9 26.33,16.64 R52.1
N$18
  Top 0.203: R4.1 R8.1 C3.2 33.25,10.22 IC3.1
N$19  (via drill 0.3)
  Top 0.178: IC2.6 IC2.7 38.83,24.59 38.83,21 41.7,18.12 v43.08,18.12 | R74.2 46.32,17.01 v45.2,18.12
  Bottom 0.178: v45.2,18.12 v43.08,18.12
N$20
  Top 0.203: R25.1 49.91,2.13 J13.TIP@3
N$21
  Top 0.203: J12.TIP@3 40.1,17.22 R24.1
N$22  (via drill 0.3)
  Top 0.203: R72.1 12.63,76.24 R65.1 10.96,76.12 v10.96,72.38 | R71.1 28.45,44.75 30.7,44.75 31.32,45.37 IC4.6 31.32,49.11 R66.2 C9.1 31.47,52.11 27.58,56 v25.58,56 | v12.96,70.38 12.96,68.88 17.7,64.12 19.95,64.12 21.7,62.38 21.7,61.38 22.7,60.38 v25.2,60.38
  Bottom 0.203: v12.96,70.38 v10.96,72.38 | v25.2,60.38 25.2,56.38 v25.58,56
N$23
  Top 0.203: R10.1 57.88,48.26 D40.-
N$24
  Top 0.203: R53.1 C2.2 R5.1 27.9,10.21 IC3.14
N$25  (via drill 0.3)
  Top 0.203: Q3.B 52.65,34.62 v53.7,34.62 | v55.7,37.12 57.19,38.61 R21.2
  Bottom 0.203: v53.7,34.62 54.33,35.25 54.33,36.38 55.08,37.12 v55.7,37.12
N$26
  Top 0.178: IC2.13 IC2.14
N$27  (via drill 0.3)
  Top 0.203: R64.2 41.58,32.05 41.58,39.75 41.08,40.25 41.08,44 39.95,45.12 39.95,50.38 38.2,52.12 v37.2,52.12 | v37.2,53.38 37.39,53.56 IC8.15
  Bottom 0.203: v37.2,52.12 v37.2,53.38
N$28
  Top 0.203: R62.1 25.44,22.7 D28.+
N$29  (via drill 0.3)
  Top 0.203: J7.TIP@3 50.43,36.95 Q3.C 50.43,34.65 v50.45,34.62 | v47.83,34.62 47.83,35.54 R19.1
  Bottom 0.203: v50.45,34.62 v47.83,34.62
N$30
  Top 0.203: R67.1 44.68,47.75 D4.+
N$31
  Top 0.203: IC7.1 50.33,86.75 49.95,87.12 45.44,87.12 R60.2
N$32
  Top 0.203: R61.1 44.68,27.43 D29.+
N$33
  Top 0.203: J1.TIP@3 10.95,62.6 R14.2
N$34  (via drill 0.3)
  Top 0.203: R28.1 36.18,37.56 C16.1 R22.2 36.41,39.16 IC4.13 36.41,43.05 36.2,43.25 v31.95,43.25 | R14.1 12.64,60.99 R30.1 12.67,50.91 13.46,50.12 v13.83,50.12 | v28.83,46 24.33,50.5 v24.08,50.5 | v18.2,50.12 21.45,50.12 v22.58,49
  Bottom 0.203: v31.95,43.25 31.58,43.25 v28.83,46 | v13.83,50.12 v18.2,50.12 | v22.58,49 v24.08,50.5
N$35
  Top 0.203: IC7.2 47.08,85.62 46.2,84.75 46.2,81.88 45.61,81.28 R33.2
N$36
  Top 0.203: IC7.3 47.47,85.14 46.7,84.38 46.7,78.23 R55.2
N$37
  Top 0.203: IC7.4 47.71,84.63 47.2,84.12 47.2,77.25 43.95,74 43.95,71.92 R35.2
N$38
  Top 0.203: IC8.1 38.83,54.12 39.08,53.88 39.08,52.12 40.45,50.75 40.45,45.38 41.58,44.25 41.58,40.62 43.95,38.25 43.95,36.36 R56.2
N$39
  Top 0.203: IC8.2 40.7,55.76 40.95,55.5 40.95,45.88 42.33,44.5 43.08,44.5 43.95,43.62 43.95,41.5 43.2,40.75 | 43.2,40.75 43.08,40.62 | 43.2,40.75 R54.2
N$40
  Top 0.203: IC8.3 41.09,56.24 41.45,55.88 41.45,47.42 R67.2
N$41
  Top 0.203: IC8.4 41.33,56.75 41.95,56.12 41.95,55.12 42.58,54.5 43.08,54.5 43.95,53.62 43.95,51.6 R32.2
N$42
  Top 0.203: IC8.5 41.78,57.25 R31.2
N$43
  Top 0.203: R11.2 25.98,93.4 28.83,96.25 38.45,96.25 39.33,95.38 39.33,94.02 Q2.B
N$44
  Top 0.203: R49.1 57.88,33.02 D41.-
N$45
  Top 0.203: R48.1 57.88,63.5 D44.-
N$46  (via drill 0.3)
  Top 0.203: 32.9,21.95 R39.2 | IC2.2 32.61,22.23 R39.2 | 29.69,26.62 R40.1 29.69,26.6 C20.1 28.16,23.58 27.33,22.75 | R13.1 16.09,15.88 20.33,20.12 v20.33,20.75 | 27.33,22.75 26.83,22.75 26.2,23.38 26.2,24.75 25.83,25.12 24.7,25.12 v22.08,22.5 | R41.1 32.84,21 | 32.84,21 32.84,21.96 R39.2 | 32.84,21 29.08,21 27.33,22.75
  Bottom 0.203: v20.33,20.75 v22.08,22.5
N$47
  Top 0.203: J6.TIP@3 23.02,93.72 R11.1
N$48
  Top 0.203: IC8.6 40.59,57.76 40.7,57.88 40.7,59.88 41.7,60.88 43.07,60.88 R36.2
N$49
  Top 0.203: IC9.1 30.38,58.7 30.2,58.88 24.45,58.88 13.71,48.12 13.71,44 18.08,39.62 18.08,36.62 14.2,32.74 R59.2
N$50
  Top 0.203: IC9.2 24.58,58.24 14.21,47.88 14.21,44.38 18.7,39.88 18.7,36.5 14.83,32.62 14.83,30.75 15.97,29.61 R58.2
N$51
  Top 0.203: R60.1 43.15,86.87 D3.+
N$52
  Top 0.203: IC9.3 24.84,57.76 14.71,47.62 14.71,44.75 19.45,40 19.45,36.5 15.58,32.62 15.58,31.12 16.45,30.25 16.45,26.75 17.2,26 17.2,22.88 14.58,20.25 R57.2
N$53
  Top 0.203: IC9.4 25.08,57.25 22.08,54.25 22.08,50.5 24.83,47.75 24.83,41.62 27.33,39.12 27.33,31.89 R63.2
N$54
  Top 0.203: IC9.5 25.33,56.75 22.7,54.12 22.7,50.75 25.33,48.12 25.33,41.88 28.45,38.75 28.45,26.62 26.97,25.14 R62.2
N$55  (via drill 0.3)
  Top 0.203: R61.2 42.68,25.4 41.08,27 41.08,39.38 40.58,39.88 40.58,43.75 39.7,44.62 v37.7,44.62 | v32.58,49.12 32.45,49.25 32.45,51.75 28.58,55.62 28.58,56.25 29.58,56.25 IC9.6
  Bottom 0.203: v37.7,44.62 37.08,44.62 v32.58,49.12
N$56  (via drill 0.3)
  Top 0.203: IC2.9 37.69,32.43 R75.2 | R75.2 37.58,33.88 C23.1 37.6,34.14 | R75.2 37.49,32.46 R77.1 35.83,32.5 34.33,32.5 32.7,34.12 v30.58,34.12 | R76.1 25.98,88.72 23.95,90.75 21.95,90.75 21.2,90 13.46,90 9.58,86.12 9.58,75.62 10.46,74.75 10.46,73.25 8.96,71.75 8.96,55.12 3.96,50.12 3.96,41.75 8.46,37.25 8.46,35.62 10.71,33.38 11.83,33.38 12.21,33 v13.58,33 | v19.2,33.5 21.83,33.5 v22.33,33 | v26.7,34 v25.33,34
  Bottom 0.203: v13.58,33 17.95,33 18.08,32.88 18.58,32.88 v19.2,33.5 | v22.33,33 24.33,33 v25.33,34 | v26.7,34 30.45,34 v30.58,34.12
N$57
  Top 0.203: Q4.B 57.06,19.11 57.95,20 57.95,23.3 R38.2
N$58  (via drill 0.3)
  Top 0.203: J8.TIP@3 52.17,21.76 | 52.17,21.76 Q4.C | R37.1 47.85,20.35 v48.08,20.12 | v50.58,20.12 50.58,20.17 52.17,21.76
  Bottom 0.203: v48.08,20.12 v50.58,20.12
N$59  (via drill 0.3)
  Top 0.203: D5.+ 53.44,17.02 51.83,18.62 v50.58,18.62 | v48.58,18.62 48.58,17.25 R74.1
  Bottom 0.203: v50.58,18.62 v48.58,18.62
N$61  (via drill 0.3)
  Top 0.203: J9.TIP@3 28.14,94.56 v26.7,93.12 | v24.7,91.12 25.46,91.12 R76.2
  Bottom 0.203: v26.7,93.12 v24.7,91.12
N$64  (via drill 0.3)
  Top 0.381: v56.83,84.62 56.83,85.21 D2.2
  Bottom 0.381: J14.1 J14.2 56.84,84.89 v56.83,84.62
N$68  (via drill 0.3)
  Top 0.203: Q7.B 52.55,65.09 v53.08,65.62 | v56.83,68.25 57.68,68.25 R44.2
  Bottom 0.203: v53.08,65.62 55.7,68.25 v56.83,68.25
N$69
  Top 0.203: R43.1 Q7.C 50.07,67.06 J10.TIP@3
N$71  (via drill 0.3)
  Top 0.203: Q8.B 53.08,50 v53.7,50.38 | v56.08,52.25 57.26,53.43 R46.2
  Bottom 0.203: v53.7,50.38 55.58,52.25 v56.08,52.25
N$72  (via drill 0.3)
  Top 0.203: J11.TIP@3 50.55,52.3 Q8.C 50.38,50.8 50.38,50.05 v49.95,49.62 | v47.95,49.62 47.95,50.7 R45.1
  Bottom 0.203: v49.95,49.62 v47.95,49.62
N$73
  Top 0.203: D27.+ 13,18.63 R57.1
N$74
  Top 0.203: R56.1 44.68,37.59 D26.+
N$75
  Top 0.203: R58.1 14.2,24 D25.+
N$76
  Top 0.203: R59.1 10.92,29.59 D24.+
N$77
  Top 0.203: D30.+ 27.19,30.23 R63.1
N$78
  Top 0.203: R64.1 44.68,32.51 D31.+
N$79
  Top 0.203: R33.1 43.15,81.79 D32.+
N$80
  Top 0.203: R32.1 44.68,52.83 D33.+
N$81
  Top 0.203: R31.1 44.68,57.91 D34.+
N$82
  Top 0.203: R34.1 44.68,68.07 D35.+
N$83
  Top 0.203: R55.1 43.15,76.71 D36.+
N$84
  Top 0.203: R54.1 44.68,42.67 D37.+
N$85
  Top 0.203: R35.1 44.68,73.15 D38.+
N$86
  Top 0.203: R36.1 44.68,62.99 D39.+
OUT_ATTACK
  Top 0.203: IC7.15 53.59,85.62 57.33,81.88 57.33,80.12 58.45,79 58.45,78.42 R47.2 58.58,76.9 58.58,75.25 57.88,74.56 R44.1
OUT_CUR_PRERES
  Top 0.203: R25.2 27.2,2.13 22.58,6.75 22.58,11.38 23.7,12.5 23.7,15 22.45,16.25 22.45,17.38 23.7,18.62 25.35,18.62 R52.2 IC3.8 30.99,17.91 31.83,18.75 33.33,18.75 33.95,19.38 33.95,22.25 34.52,22.81 34.52,26.31 34.95,26.75 36.08,26.75 36.45,26.38 36.45,24.68 | 36.45,24.12 36.45,24.68 | 36.45,24.68 IC2.5
OUT_DECAY
  Top 0.203: R46.1 R48.2 57.12,60.83 55.58,62.38 55.58,64.25 54.95,64.88 54.95,65.88 55.95,66.88 55.95,70.5 54.45,72 54.45,75.25 55.45,76.25 55.45,78.5 54.83,79.12 49.95,79.12 48.83,80.25 48.83,82.57 IC7.7
OUT_LIN_PRERES
  Top 0.203: IC3.7 35.17,17.91 R6.2 37.14,18.51 R24.2
OUT_RELEASEDONE
  Top 0.203: R38.1 R49.2 54.83,33.41 54.83,39.25 53.45,40.62 53.45,44.88 54.45,45.88 54.45,55.38 53.7,56.12 53.7,60.38 54.58,61.25 54.58,63.5 53.7,64.38 53.7,66.5 54.95,67.75 54.95,70 53.45,71.5 53.45,72.25 49.58,76.12 49.58,78 47.7,79.88 47.7,83.75 48.08,84.12 IC7.5
OUT_RELEASESTART
  Top 0.203: R21.1 R10.2 54.95,48.52 54.95,55.62 54.2,56.38 54.2,60.12 55.08,61 55.08,63.88 54.33,64.62 54.33,66.12 55.45,67.25 55.45,70.25 53.95,71.75 53.95,75.5 54.95,76.5 54.95,78.12 54.45,78.62 49.7,78.62 48.2,80.12 48.2,83.38 48.45,83.62 49.37,83.62 IC7.6
REF_-5V  (via drill 0.3)
  Top 0.203: R3.2 37.94,36.11 37.2,35.38 35.83,35.38 | 35.83,35.38 35.55,35.38 R28.2 34.66,36.2 33.83,35.38 30.96,35.38 | 30.96,35.38 R15.2 29.73,36.23 29.08,36.88 29.08,40.75 v28.58,41.25 | 30.08,34.5 29.7,34.12 R40.2 | 30.08,34.5 30.96,35.38 | R77.2 35.95,35.25 35.83,35.38 | v28.58,43.25 27.72,43.25 R71.2 | U2.2 5.19,15.61 5.46,15.88 5.46,17.25 C6.2 | C6.2 5.11,17.88 R26.2 | C6.2 6.95,17.88 7.71,17.12 15.46,17.12 16.33,18 16.33,21.25 17.83,22.75 17.83,26.12 16.95,27 16.95,30.38 16.2,31.12 16.2,32.5 19.2,35.5 v22.08,35.5 | v23.83,35.5 26.33,35.5 v26.45,35.38 | v29.33,35 29.58,35 30.08,34.5
  Bottom 0.203: v28.58,41.25 v28.58,43.25 | v22.08,35.5 v23.83,35.5 | v26.45,35.38 28.95,35.38 v29.33,35
RETRIGGER_ENVELOPE  (via drill 0.3)
  Top 0.203: Q2.C 38.15,91.47 R42.1 35.7,91.5 35.2,91.5 35.08,91.62 35.08,91.88 34.33,92.62 29.58,92.62 v29.2,92.25 | IC5.8 31.57,72.11 v30.58,71.12 | v30.33,91.12 30.08,91.12 29.7,90.75 29.7,83.75 27.45,81.5 27.45,77.25 28.08,76.62 28.33,76.62 28.45,76.5 v28.45,76.38 | v28.45,74 28.2,73.75 28.2,72.12 v27.95,71.88
  Bottom 0.203: v30.58,71.12 29.83,71.88 v27.95,71.88 | v30.33,91.12 v29.2,92.25 | v28.45,74 v28.45,76.38
SCL  (via drill 0.3)
  Top 0.203: R50.2 33.76,84.62 34.7,84.62 35.31,84.02 IC6.1 35.31,77.73 v35.08,77.5 | v36.45,76 36.32,76.14 IC5.17
  Bottom 0.203: v35.08,77.5 35.08,77.38 v36.45,76
SDA
  Top 0.203: R51.2 38.51,84.62 37.7,84.62 37.2,84.11 IC6.3 37.2,82.74 36.08,81.62 36.08,77 35.7,76.62 IC5.18
SHIFTER1TO2  (via drill 0.3)
  Top 0.203: IC8.14 36.87,56.25 36.58,56.25 36.45,56.12 36.45,55 36.58,54.88 v36.7,54.88 | IC7.9 50.83,80.75 v50.7,79.75 | v48.58,77.62 46.2,75.25 46.2,70.62 45.45,69.88 42.08,69.88 41.45,69.25 41.45,65.12 39.33,63 39.33,60.5 38.7,59.88 37.2,59.88 v36.83,59.5
  Bottom 0.203: v48.58,77.62 v50.7,79.75 | v36.7,54.88 37.58,55.75 37.58,57.88 36.83,58.62 v36.83,59.5
SHIFTER2TO3  (via drill 0.3)
  Top 0.203: IC9.14 32.04,57.75 33.7,57.75 v35.33,59.38 | IC8.9 38,58.7 v37.7,59
  Bottom 0.203: v37.7,59 37.7,59.75 37.08,60.38 36.33,60.38 v35.33,59.38
SHIFTERS  (via drill 0.3)
  Top 0.203: IC7.14 52.58,85.14 v52.83,84.88 | v30.45,78.5 29.2,77.25 29.2,76.38 29.45,76.12 30.08,76.12 IC5.2 | v34.7,81.12 34.33,80.75 v32.7,80.75 | v36.7,81.12 36.7,81.25 v39.58,84.12 | v49.33,86.38 v45.95,86.38
  Bottom 0.203: v32.7,80.75 v30.45,78.5 | v36.7,81.12 v34.7,81.12 | v39.58,84.12 41.58,86.12 45.7,86.12 v45.95,86.38 | v52.83,84.88 49.83,84.88 49.33,85.38 v49.33,86.38
SWD_CLK  (via drill 0.3)
  Top 0.203: v33.58,83.25 33.58,83 32.08,81.5 IC5.22
  Bottom 0.203: SWD1.4 34.39,86.31 34.58,86.12 34.58,84.25 v33.58,83.25
SWD_DIO  (via drill 0.3)
  Top 0.203: v30.2,83.38 30.2,83 31.08,82.12 IC5.24
  Bottom 0.203: SWD1.2 31.62,84.79 v30.2,83.38
TRIGGER_ENVELOPE  (via drill 0.3)
  Top 0.203: Q1.C 26.37,91.95 R20.1 | IC5.13 34.53,73.8 36.2,72.12 37.83,72.12 38.08,72.38 38.08,73.75 37.58,74.25 v37.58,74.38 | R20.1 | v38.58,77.38 38.58,82.25 40.2,83.88 40.2,87.88 v39.95,88.12 | v39.95,90.62 39.95,92.25 39.33,92.88 35.08,92.88 34.7,93.25 27.69,93.25 R20.1
  Bottom 0.203: v38.58,77.38 38.2,77 38.2,75 v37.58,74.38 | v39.95,88.12 v39.95,90.62
TRIGGER_LED  (via drill 0.3)
  Top 0.203: R78.2 41.35,93.98 38.58,96.75 28.45,96.75 27.08,95.62 25.2,95.62 24.95,95.88 24.95,101 21.45,104.5 13.21,104.5 8.96,100.25 8.96,75 v9.83,74.12 | v12.21,74.12 14.83,74.12 18.95,70 18.95,69.12 v22.2,65.88 | IC9.15 32.08,58.3 32.08,63.25 30.33,65 25.45,65 v24.83,65.62
  Bottom 0.203: v22.2,65.88 24.58,65.88 v24.83,65.62 | v9.83,74.12 v12.21,74.12